# EAGLE design frontpanel-new (EAGLE 9.3.2)
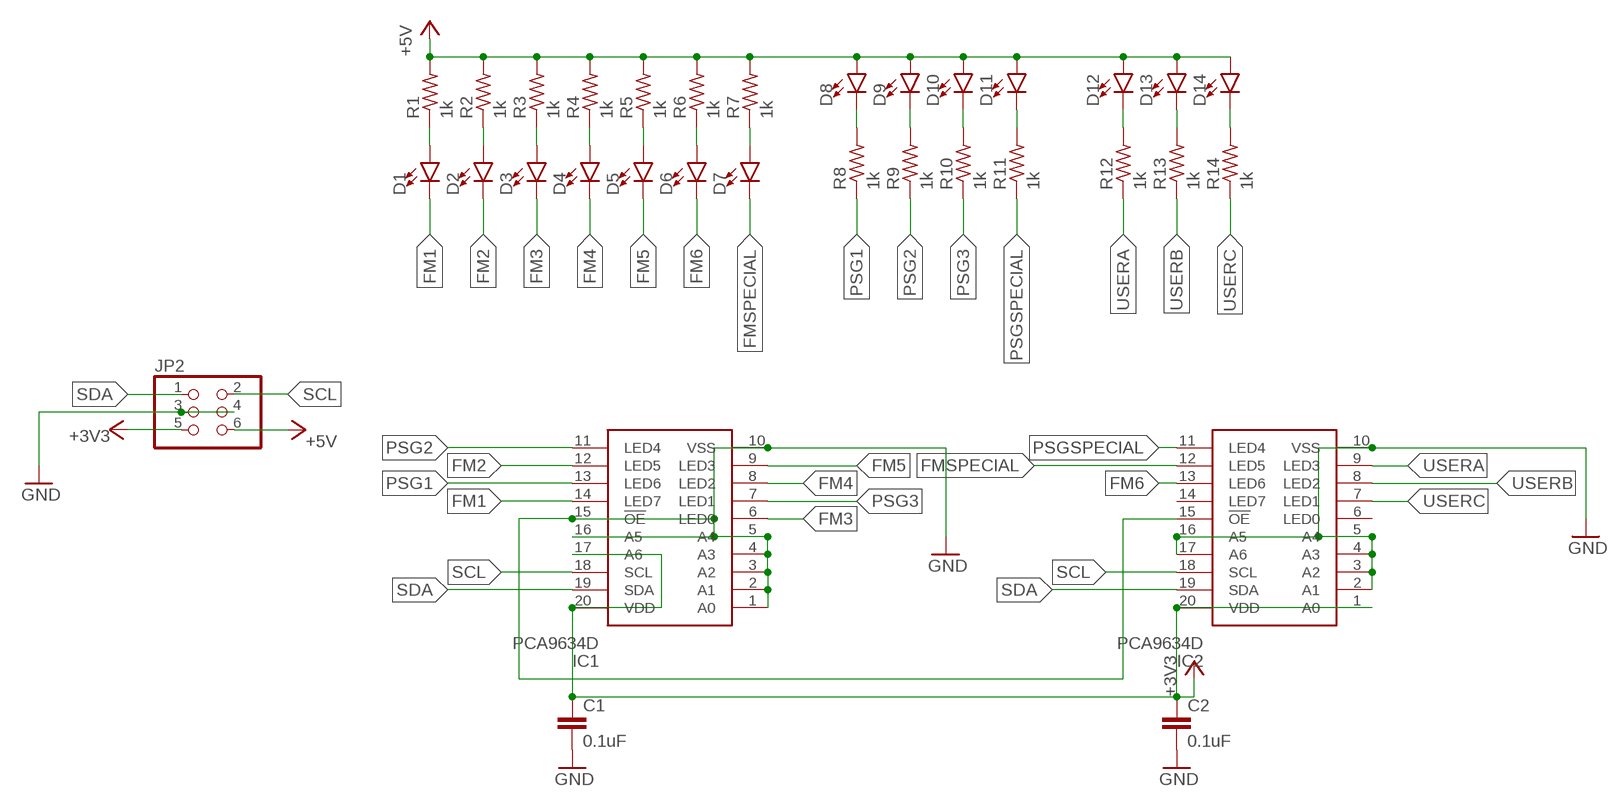
[diagram p0: schematic, sheet 1]

## Parts
C1  0.1uF  C-EUC0805  [C0805]
C2  0.1uF  C-EUC0805  [C0805]
D1  AM2520  [AM2520HOLE]
D2  AM2520  [AM2520HOLE]
D3  AM2520  [AM2520HOLE]
D4  AM2520  [AM2520HOLE]
D5  AM2520  [AM2520HOLE]
D6  AM2520  [AM2520HOLE]
D7  AM2520  [AM2520HOLE]
D8  AM2520  [AM2520HOLE]
D9  AM2520  [AM2520HOLE]
D10  AM2520  [AM2520HOLE]
D11  AM2520  [AM2520HOLE]
D12  AM2520  [AM2520HOLE]
D13  AM2520  [AM2520HOLE]
D14  AM2520  [AM2520HOLE]
IC1  PCA9634D  [SOIC127P1032X265-20N]
IC2  PCA9634D  [SOIC127P1032X265-20N]
JP2  PINHD-2X3SMT  [2X03_SMT]
R1  1k  R-US_R0805  [R0805]
R2  1k  R-US_R0805  [R0805]
R3  1k  R-US_R0805  [R0805]
R4  1k  R-US_R0805  [R0805]
R5  1k  R-US_R0805  [R0805]
R6  1k  R-US_R0805  [R0805]
R7  1k  R-US_R0805  [R0805]
R8  1k  R-US_R0805  [R0805]
R9  1k  R-US_R0805  [R0805]
R10  1k  R-US_R0805  [R0805]
R11  1k  R-US_R0805  [R0805]
R12  1k  R-US_R0805  [R0805]
R13  1k  R-US_R0805  [R0805]
R14  1k  R-US_R0805  [R0805]

## Nets
+3V3: C1.1 C2.1 IC1.17(A6) IC1.20(VDD) IC2.1(A0) IC2.20(VDD) JP2.5
+5V: D8.A D9.A D10.A D11.A D12.A D13.A D14.A JP2.6 R1.2 R2.2 R3.2 R4.2 R5.2 R6.2 R7.2
FM1: D1.C IC1.14(LED7)
FM2: D2.C IC1.12(LED5)
FM3: D3.C IC1.6(LED0)
FM4: D4.C IC1.8(LED2)
FM5: D5.C IC1.9(LED3)
FM6: D6.C IC2.13(LED6)
FMSPECIAL: D7.C IC2.12(LED5)
GND: C1.2 C2.2 IC1.1(A0) IC1.2(A1) IC1.3(A2) IC1.4(A3) IC1.5(A4) IC1.10(VSS) IC1.15(!OE) IC1.16(A5) IC2.2(A1) IC2.3(A2) IC2.4(A3) IC2.5(A4) IC2.10(VSS) IC2.15(!OE) IC2.16(A5) IC2.17(A6) JP2.3 JP2.4
N$1: D12.C R12.2
N$2: D1.A R1.1
N$3: D5.A R5.1
N$4: D3.A R3.1
N$5: D6.A R6.1
N$6: D4.A R4.1
N$7: D2.A R2.1
N$8: D7.A R7.1
N$17: D8.C R8.2
N$18: D9.C R9.2
N$19: D10.C R10.2
N$20: D11.C R11.2
N$31: D13.C R13.2
N$32: D14.C R14.2
PSG1: IC1.13(LED6) R8.1
PSG2: IC1.11(LED4) R9.1
PSG3: IC1.7(LED1) R10.1
PSGSPECIAL: IC2.11(LED4) R11.1
SCL: IC1.18(SCL) IC2.18(SCL) JP2.2
SDA: IC1.19(SDA) IC2.19(SDA) JP2.1
USERA: IC2.9(LED3) R12.1
USERB: IC2.8(LED2) R13.1
USERC: IC2.7(LED1) R14.1
Unconnected: IC2.6(LED0) IC2.14(LED7)

## Library data of the parts
C1 C2 = rcl:C-EU: CAPACITOR, European symbol; SPICEPREFIX: C
D1-D14 = kingbright-am2520:AM2520: Blue SMD LED Used in manufacturing of various products at SparkFun Packages: 0603 - SMD 0603 package [Product Link] <http://www.digikey.com/product-detail/en/SMLE12BC7TT86/511-1589-2-ND/1641808> 1206 - SMD1206 package [Product Link] <http://www.digikey.com/product-detail/en/lite-on-inc/LTST-C150TBKT/160-1643-1-ND/573584> SparkFun Products: ESP8266 Thing-Dev Board <https://www.sparkfun.com/products/13711> RedBoard <https://www.sparkfun.com/products/12757>
IC1 IC2 = PCA9634D:PCA9634D: 8-bit Fm+ I2C-bus LED driver Source: Datasheet <http://www.nxp.com/documents/data_sheet/PCA9634.pdf>; DESCRIPTION: 8-bit Fm+ I2C-bus LED driver; HEIGHT: 2.65mm; MANUFACTURER_NAME: Nexperia; MANUFACTURER_PART_NUMBER: PCA9634D; MOUSER_PART_NUMBER: N/A; MOUSER_PRICE-STOCK: https://www.mouser.com/Search/Refine.aspx?Keyword=N%2FA
JP2 = pinhead+:PINHD-2X3: PIN HEADER
R1-R14 = rcl:R-US_: RESISTOR, American symbol; SPICEPREFIX: R

## Board
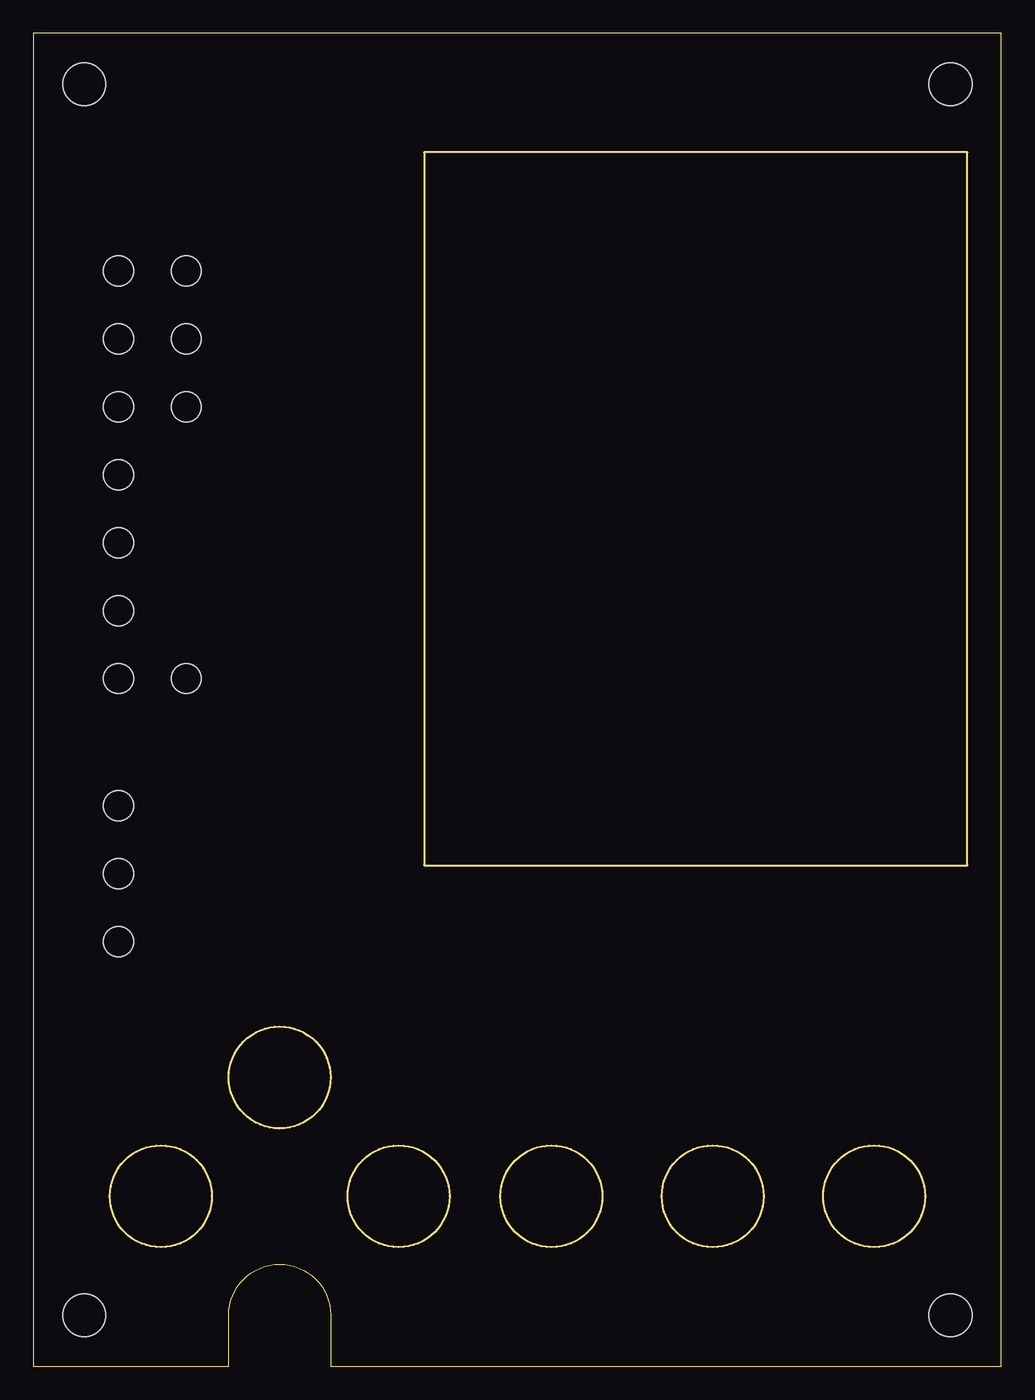
[diagram p1: board, top side]
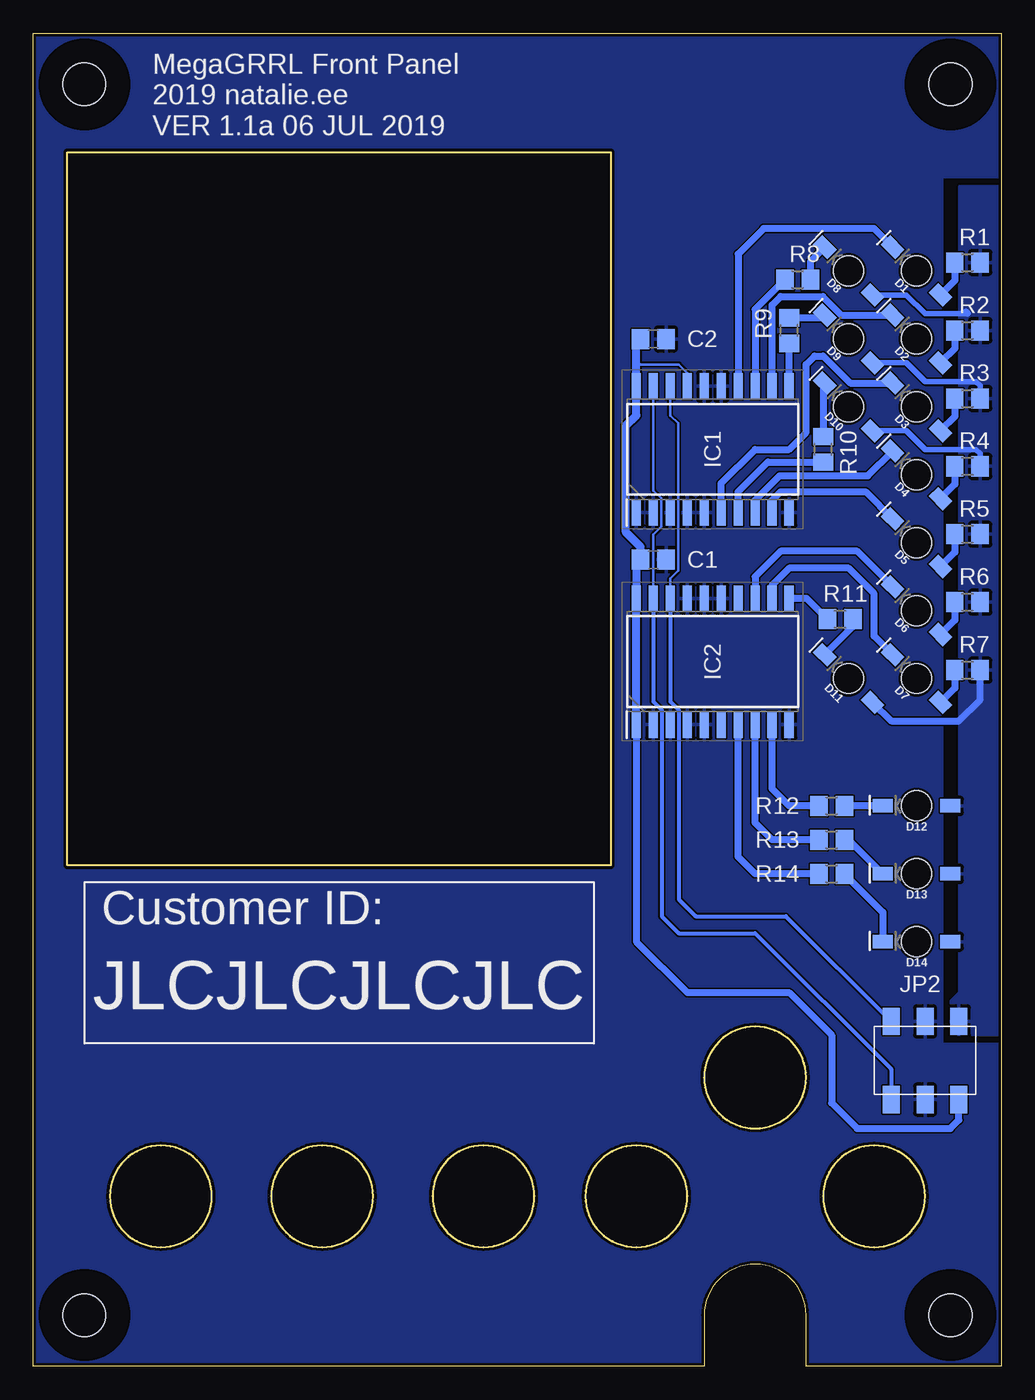
[diagram p2: board, bottom side, seen from below]

Size 72.39 x 99.69 mm. Coordinates in mm from the lower left corner, seen from the top.
Outline: 0,0 14.61,0 14.61,3.81 arc-180 22.23,3.81 22.23,0 72.39,0 72.39,99.69 0,99.69 0,0
Outline: 69.85,37.47 69.85,90.81 29.21,90.81 29.21,37.47 69.85,37.47
Outline: 5.71,12.7 arc-180 13.34,12.7 arc-180 5.71,12.7
Outline: 14.61,21.59 arc-180 22.23,21.59 arc-180 14.61,21.59
Outline: 23.5,12.7 arc-180 31.11,12.7 arc-180 23.5,12.7
Outline: 34.92,12.7 arc-180 42.55,12.7 arc-180 34.92,12.7
Outline: 46.99,12.7 arc-180 54.61,12.7 arc-180 46.99,12.7
Outline: 59.05,12.7 arc-180 66.67,12.7 arc-180 59.05,12.7
Copper layers (1*16): Top 0.035559375mm / dielectric 1.6mm / Bottom 0.035559375mm
Design rules "jlcpcb2layer": minimum track width 5mil, minimum drill 12mil, track to track 5mil, track to pad 5mil, pad to pad 5mil, via to via 5mil, smd to smd 5mil, copper to edge 8mil, drill to drill 6mil, minimum pad ring 5mil, minimum via ring 3mil, stop-mask expansion 2.5mil, vias tented up to drill 0mil, thermal gap 10mil
Holes 3.2 mm at 3.81,95.89 68.58,95.89 68.58,3.81 3.81,3.81
bRestrict: area 0.6,92.7 to 7,99.1; area 65.4,92.7 to 71.8,99.1; area 65.4,0.6 to 71.8,7; area 0.6,0.6 to 7,7

### Footprints (pad centres in the part's own frame; a part is rotated, then mirrored left to right if it is on the bottom)
C0805 = smd 1.3 x 1.5: 1 -0.95,0; 2 0.95,0
AM2520HOLE = smd 1.5 x 1: A -2.525,0; C 2.525,0 | hole 2.25: 0,0
SOIC127P1032X265-20N = smd 1.95 x 0.7: 1 -4.725,5.715; 2 -4.725,4.445; 3 -4.725,3.175; 4 -4.725,1.905; 5 -4.725,0.635; 6 -4.725,-0.635; 7 -4.725,-1.905; 8 -4.725,-3.175; 9 -4.725,-4.445; 10 -4.725,-5.715; 11 4.725,-5.715; 12 4.725,-4.445; 13 4.725,-3.175; 14 4.725,-1.905; 15 4.725,-0.635; 16 4.725,0.635; 17 4.725,1.905; 18 4.725,3.175; 19 4.725,4.445; 20 4.725,5.715
2X03_SMT = smd 1.27 x 2.032: 1 -2.54,-2.921; 2 -2.54,2.921; 3 0,-2.921; 4 0,2.921; 5 2.54,-2.921; 6 2.54,2.921
R0805 = smd 1.3 x 1.5: 1 -0.95,0; 2 0.95,0

### Placement (x,y rotation side)
C1  26.04,60.33 0 bottom
C2  26.04,76.83 0 bottom
D1  6.35,81.92 135 bottom
D2  6.35,76.83 135 bottom
D3  6.35,71.75 135 bottom
D4  6.35,66.67 135 bottom
D5  6.35,61.59 135 bottom
D6  6.35,56.52 135 bottom
D7  6.35,51.44 135 bottom
D8  11.43,81.92 135 bottom
D9  11.43,76.83 135 bottom
D10  11.43,71.75 135 bottom
D11  11.43,51.44 135 bottom
D12  6.35,41.91 180 bottom
D13  6.35,36.83 180 bottom
D14  6.35,31.75 180 bottom
IC1  21.59,68.58 90 bottom
IC2  21.59,52.7 90 bottom
JP2  5.71,22.86 0 bottom
R1  2.54,82.55 0 bottom
R2  2.54,77.47 0 bottom
R3  2.54,72.39 0 bottom
R4  2.54,67.31 0 bottom
R5  2.54,62.23 0 bottom
R6  2.54,57.15 0 bottom
R7  2.54,52.07 0 bottom
R8  15.24,81.28 0 bottom
R9  15.88,77.47 90 bottom
R10  13.34,68.58 90 bottom
R11  12.06,55.88 0 bottom
R12  12.7,41.91 0 bottom
R13  12.7,39.37 0 bottom
R14  12.7,36.83 0 bottom

### Tracks (layer width: path | path; a pad name or v marks a point on that pad's centre or on a via)
+3V3
  Bottom 0.203: IC1.17 23.5,74.3 24.13,74.93 27.3,74.93
  Bottom 0.406: C1.1 27.3,60.33 | 27.3,76.52 C2.1
  Bottom 0.508: IC2.1 27.3,31.75 23.5,27.94 15.88,27.94 12.7,24.77 12.7,19.68 10.79,17.78 3.81,17.78 3.17,18.41 JP2.5
  Bottom 0.61: 27.3,60.33 IC2.20 IC2.1 | 27.3,76.52 27.3,74.93 IC1.20 27.3,71.12 28.09,70.34 28.09,62.38 26.98,61.27 C1.1
+5V
  Bottom 0.406: 2.92,26.04 JP2.6 | D8.A 7.11,80.13 5.71,78.74 2.54,78.74 | D9.A 7.11,75.05 5.71,73.66 1.91,73.66 1.59,73.34 R3.2 | D10.A 7.11,69.97 5.71,68.58 1.91,68.58 1.59,68.27 R4.2
  Bottom 0.508: 2.54,78.74 2.67,78.86 | D11.A 8.26,48.26 3.17,48.26 1.59,49.84 R7.2
  pour Bottom: -0.64,88.27 3.17,88.27 3.17,27.94 3.81,27.3 3.81,24.77 -0.64,24.77
FM1
  Bottom 0.508: D1.C 9.53,85.09 17.78,85.09 19.68,83.19 IC1.14
FM2
  Bottom 0.508: D2.C 11.97,78.62 13.36,80.01 16.51,80.01 17.14,79.38 IC1.12
FM3
  Bottom 0.508: IC1.6 20.95,66.04 18.41,68.58 15.88,68.58 14.61,69.85 14.61,74.93 13.97,75.56 13.34,75.56 11.31,73.54 D3.C
FM4
  Bottom 0.508: IC1.8 18.41,64.77 16.59,66.6 10,66.6 D4.C
FM5
  Bottom 0.508: IC1.9 17.14,64.77 16.51,65.41 10.16,65.41 D5.C | D5.C
FM6
  Bottom 0.508: D6.C 10.79,60.96 16.51,60.96 18.41,59.05 IC2.13
FMSPECIAL
  Bottom 0.508: D7.C 9.53,54.61 9.53,57.78 11.43,59.69 15.88,59.69 17.14,58.42 IC2.12
GND
  pour Bottom: -3.17,101.6 -3.17,88.9 4.45,88.9 4.45,24.13 -1.91,24.13 -1.91,-1.91 74.3,-1.91 74.3,101.6
N$1
  Bottom 0.508: D12.C R12.2
N$2
  Bottom 0.508: R1.1 3.49,81.2 D1.A
N$3
  Bottom 0.508: R5.1 3.49,60.88 D5.A
N$4
  Bottom 0.508: R3.1 3.49,71.04 D3.A
N$5
  Bottom 0.508: R6.1 3.49,55.8 D6.A
N$6
  Bottom 0.508: R4.1 3.49,65.96 D4.A
N$7
  Bottom 0.508: R2.1 3.49,76.12 D2.A
N$8
  Bottom 0.508: R7.1 3.49,50.72 D7.A
N$17
  Bottom 0.508: D8.C 14.29,82.63 R8.2
N$18
  Bottom 0.508: R9.2 13.42,78.42 D9.C
N$19
  Bottom 0.508: D10.C 13.34,73.42 R10.2
N$20
  Bottom 0.508: D11.C 11.12,55.32 R11.2
N$31
  Bottom 0.508: R13.2 11.41,39.37 D13.C
N$32
  Bottom 0.508: R14.2 8.88,33.95 D14.C
PSG1
  Bottom 0.508: R8.1 18.41,79.06 IC1.13
PSG2
  Bottom 0.508: IC1.11 R9.1
PSG3
  Bottom 0.508: R10.1 17.46,67.63 19.68,65.41 IC1.7
PSGSPECIAL
  Bottom 0.508: R11.1 14.56,57.43 IC2.11
SCL
  Bottom 0.203: IC2.18 24.77,58.92 24.19,59.5 24.19,64.77 24.19,64.92 24.19,70.54 24.77,71.12 IC1.18
  Bottom 0.305: JP2.2 16.13,33.66 22.86,33.66 24.13,34.92 24.13,49.06 24.77,49.7 IC2.18
SDA
  Bottom 0.203: IC2.19 26.04,62.21 25.46,62.78 25.46,64.92 26.04,65.5 IC1.19
  Bottom 0.305: IC2.19 26.04,49.7 25.4,49.06 25.4,33.66 24.13,32.38 18.41,32.38 8.26,22.23 JP2.1
USERA
  Bottom 0.508: R12.1 15.88,41.91 17.14,43.18 IC2.9
USERB
  Bottom 0.508: R13.1 17.14,39.37 18.41,40.64 IC2.8
USERC
  Bottom 0.508: R14.1 18.41,36.83 19.68,38.1 IC2.7

### Text on the board
bNames: MegaGRRL Front Panel / 2019 natalie.ee / VER 1.1a 06 JUL 2019 | Customer ID: | JLCJLCJLCJLC
tDocu: CUT / OUT | CUT / OUT | CUT / OUT | CUT / OUT | CUT / OUT | CUT / OUT | CUT / OUT